# EAGLE schematic power (EAGLE 7.4.0)
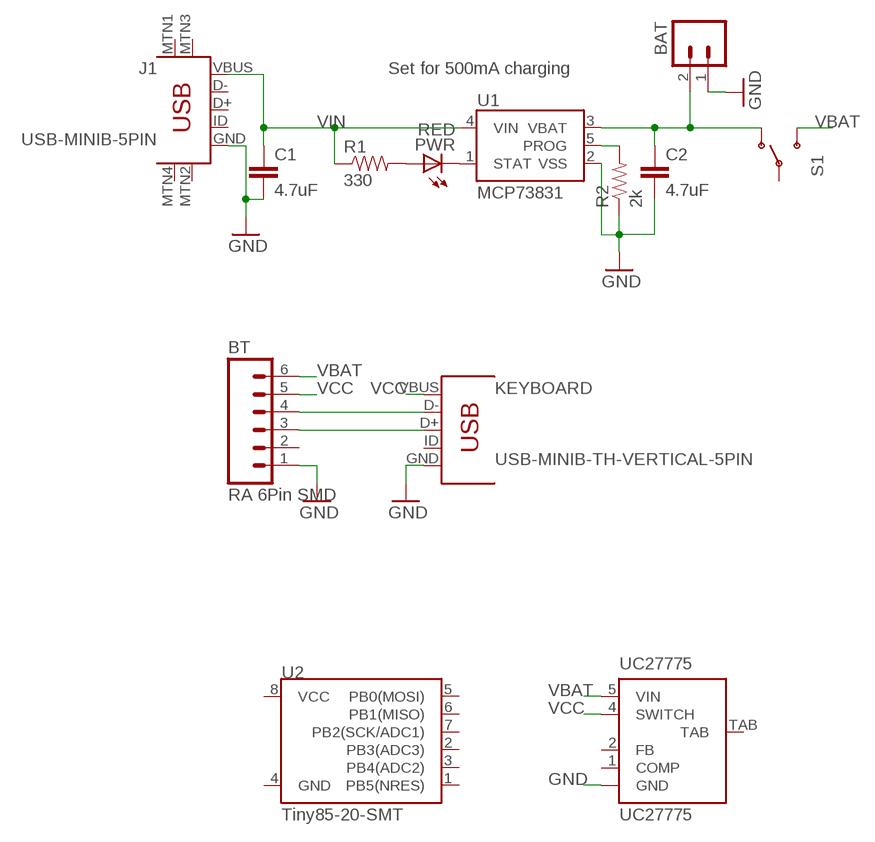
[diagram p0: schematic, sheet 1]

## Parts
BAT  LiPo Battery  M02-JST-2MM-SMT  [JST-2-SMD]
BT  RA 6Pin SMD  M06SMD-NOHOLES  [1X06-SMD-NOHOLES]
C1  4.7uF  1.0UF-25V-+80/-20(0805)"  [0805-CAP]
C2  4.7uF  1.0UF-25V-+80/-20(0805)"  [0805-CAP]
J1  USB-MINIB-5PIN  [USB-MINIB]
KEYBOARD  USB-MINIB-TH-VERTICAL-5PIN  [USB-MINIB-TH-VERTICAL]
PWR  RED  LED0603  [LED-0603]
R1  330  0.22OHM-1/4W-1%(0805)  [0805]
R2  2k  0.22OHM-1/4W-1%(0805)  [0805]
S1  SWITCH-SPDT-SMD-A  [SWITCH-SPST-SMD-A]
U1  MCP73831  [SOT23-5]
U2  Tiny85-20-SMT  ATTINY45TINY85-20-SMT  [SO08-EIAJ]
UC27775  UC27775  [TO263_5]

## Nets
GND: BAT.1 BT.1 C1.2 C2.2 J1.GND KEYBOARD.GND R2.1 U1.2(VSS) UC27775.3(GND)
N$2: BT.4 KEYBOARD.D-
N$3: BT.3 KEYBOARD.D+
N$12: PWR.A R1.2
PROG: R2.2 U1.5(PROG)
STAT: PWR.C U1.1(STAT)
VBAT: BT.6 S1.3(S) UC27775.5(VIN)
VBAT2: BAT.2 C2.1 S1.1(O) U1.3(VBAT)
VCC: BT.5 KEYBOARD.VBUS UC27775.4(SWITCH)
VIN: C1.1 J1.VBUS R1.1 U1.4(VIN)
Unconnected: BT.2 J1.D+ J1.D- J1.ID J1.MTN1(MTN2) J1.MTN2(MTN3) J1.MTN3(MTN1) J1.MTN4 KEYBOARD.ID S1.2(P) U2.1(PB5(NRES)) U2.2(PB3(ADC3)) U2.3(PB4(ADC2)) U2.4(GND) U2.5(PB0(MOSI)) U2.6(PB1(MISO)) U2.7(PB2(SCK/ADC1)) U2.8(VCC) UC27775.1(COMP) UC27775.2(FB) UC27775.TAB

## Notes on the sheet
- Set for 500mA charging

## Library data of the parts
BAT = SparkFun:M02: Header 2 Standard 2-pin 0.1" header. Use with straight break away headers (SKU : PRT-00116), right angle break away headers (PRT-00553), swiss pins (PRT-00743), machine pins (PRT-00117), and female headers (PRT-00115). Molex polarized connector foot print use with SKU : PRT-08233 with associated crimp pins and housings.
BT = mine:M06: Header 6 Standard 6-pin 0.1" header. Use with straight break away headers (SKU : PRT-00116), right angle break away headers (PRT-00553), swiss pins (PRT-00743), machine pins (PRT-00117), and female headers (PRT-00115). Molex polarized connector foot print use with SKU : PRT-08094 with associated crimp pins and housings. NOTES ON THE VARIANTS LOCK and LOCK_LONGPADS... This footprint was designed to help hold the alignment of a through-hole component (i.e. 6-pin header) while soldering it into place. You may notice that each hole has been shifted either up or down by 0.005 of an inch from it's more standard position (which is a perfectly straight line). This slight alteration caused the pins (the squares in the middle) to touch the edges of the holes. Because they are alternating, it causes a "brace" to hold the component in place. 0.005 has proven to be the perfect amount of "off-center" position when using our standard breakaway headers. Although looks a little odd when you look at the bare footprint, once you have a header in there, the alteration is very hard to notice. Also,if you push a header all the way into place, it is covered up entirely on the bottom side. This idea of altering the position of holes to aid alignment will be further integrated into the Sparkfun Library for other footprints. It can help hold any component with 3 or more connection pins.; PROD_ID: CONN-08971
C1 C2 = SparkFun-Capacitors:1.0UF-25V-+80/-20(0805): CAP-11625; PROD_ID: CAP-11625; VALUE: 1.0uF
J1 = SparkFun-Connectors:USB-MINIB: Mini-USB "B" connector with 5th pin broken out. Created new symbol breaking out 5th "ID" pin in mini/micro USB connector spec. See: http://en.wikipedia.org/wiki/Mini_usb#Cables. Uses same footprint as 4-pin symbol. Also added pins to connect to mounting / shield pads if required (probably not generally needed as signals aren't shielded once they leave the connector).; PROD_ID: CONN-08193
KEYBOARD = mine:USB-MINIB-TH-VERTICAL: Mini-USB "B" connector with 5th pin broken out. Created new symbol breaking out 5th "ID" pin in mini/micro USB connector spec. See: http://en.wikipedia.org/wiki/Mini_usb#Cables. Uses same footprint as 4-pin symbol. Also added pins to connect to mounting / shield pads if required (probably not generally needed as signals aren't shielded once they leave the connector).; PROD_ID: CONN-08193
PWR = SparkFun:LED: LEDs Standard schematic elements and footprints for 5mm, 3mm, 1206, and 0603 sized LEDs. 5mm - Spark Fun Electronics SKU : COM-00529 (and others)
R1 R2 = SparkFun-Resistors:0.22OHM-1/4W-1%(0805): RES-09883; PROD_ID: RES-09883; VALUE: 0.22
S1 = SparkFun-Electromechanical:SWITCH-SPDT: SPDT Switch Simple slide switch, Spark Fun Electronics SKU : COM-00102 DPDT SMT slide switch, AYZ0202, SWCH-08179
U1 = SparkFun:MCP73831: Microchip's MCP73831 Miniature single cell, fully integrated Li-Ion, Li-polymer charge management controller http://ww1.microchip.com/downloads/en/DeviceDoc/21984a.pdf
U2 = SparkFun-DigitalIC:ATTINY45: Atmel 8-pin 2/4/8kB flash uC; PROD_ID: IC-09092
UC27775 = mine:UC27775: 1A Constant-Current LED Driver with PWM Dimming Source: ON Semiconductor .. 4101.pdf; MF: TI